# EAGLE design Simon-2022 (EAGLE 9.6.2)
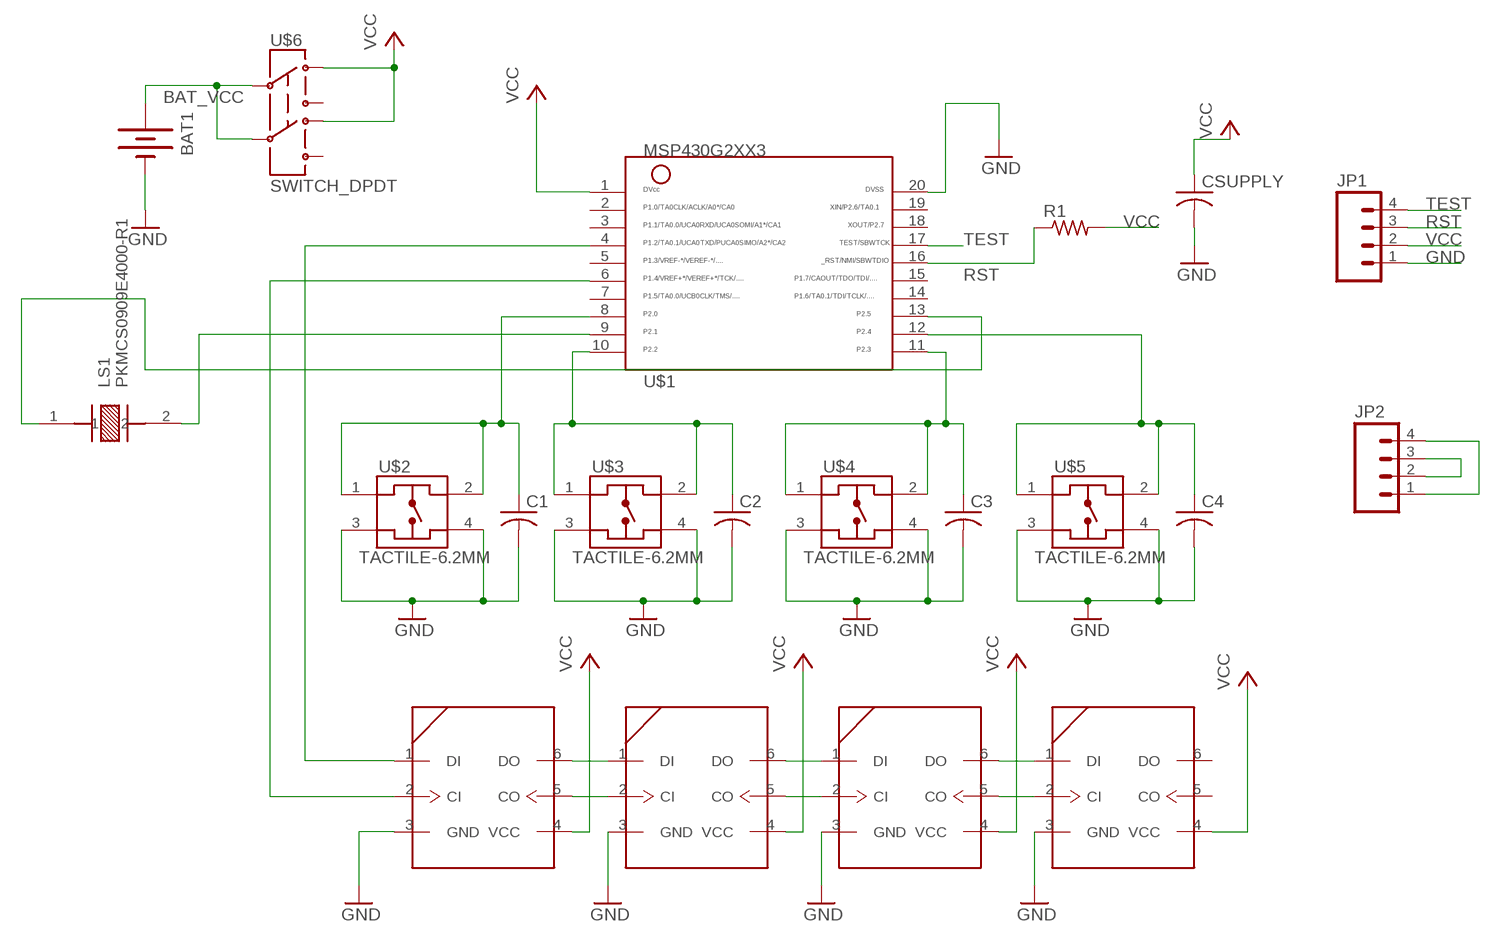
[diagram p0: schematic, sheet 1]

## Parts
BAT1  BATTERY  [BATTERY_PACK_2AA]
C1  C-USC1206  [C1206]
C2  C-USC1206  [C1206]
C3  C-USC1206  [C1206]
C4  C-USC1206  [C1206]
CSUPPLY  C-USC1206  [C1206]
JP1  M04LOCK  [1X04_LOCK]
JP2  M04LOCK  [1X04_LOCK]
LED1  APA102  [5050]
LED2  APA102  [5050]
LED3  APA102  [5050]
LED4  APA102  [5050]
LS1  PKMCS0909E4000-R1  [XDCR_PKMCS0909E4000-R1]
R1  R-US_R1206  [R1206]
U$1  MSP430G2XX3TSSOP  [PW20]
U$2  TACTILE-6.2MM  [222_AM]
U$3  TACTILE-6.2MM  [222_AM]
U$4  TACTILE-6.2MM  [222_AM]
U$5  TACTILE-6.2MM  [222_AM]
U$6  SWITCH_DPDT  [JS_DPDT_TH]

## Nets
BAT_VCC: BAT1.3V(+) U$6.2 U$6.5
GND: BAT1.GND(-) C1.2 C2.2 C3.2 C4.2 CSUPPLY.2 JP1.1 LED1.3(GND) LED2.3(GND) LED3.3(GND) LED4.3(GND) U$1.20 U$2.3 U$2.4 U$3.3 U$3.4 U$4.3 U$4.4 U$5.3 U$5.4
N$1: LED1.6(DO) LED2.1(DI)
N$2: LED1.5(CO) LED2.2(CI)
N$3: LED2.6(DO) LED3.1(DI)
N$4: LED2.5(CO) LED3.2(CI)
N$5: LED3.6(DO) LED4.1(DI)
N$6: LED3.5(CO) LED4.2(CI)
N$7: LED1.1(DI) U$1.4
N$8: LED1.2(CI) U$1.6
N$9: C2.1 U$1.10 U$3.1 U$3.2
N$10: LS1.2 U$1.9
N$11: LS1.1 U$1.13
N$12: C1.1 U$1.8 U$2.1 U$2.2
N$13: JP2.1 JP2.4
N$14: JP2.2 JP2.3
N$16: C3.1 U$1.11 U$4.1 U$4.2
N$20: C4.1 U$1.12 U$5.1 U$5.2
RST: JP1.3 R1.1 U$1.16
TEST: JP1.4 U$1.17
VCC: CSUPPLY.1 JP1.2 LED1.4(VCC) LED2.4(VCC) LED3.4(VCC) LED4.4(VCC) R1.2 U$1.1 U$6.1 U$6.4
Unconnected: LED4.5(CO) LED4.6(DO) U$1.2 U$1.3 U$1.5 U$1.7 U$1.14 U$1.15 U$1.18 U$1.19 U$6.3 U$6.6

## Library data of the parts
BAT1 = ELEC327:BATTERY: Battery Holders Various common sizes : AA, AAA, 20mm coin cell and 12mm coin cell. 20MM_4LEGS, BATT-10373
C1-C4 CSUPPLY = rcl:C-US: CAPACITOR, American symbol; SPICEPREFIX: C
JP1 JP2 = SparkFun:M04: Header 4 Standard 4-pin 0.1" header. Use with straight break away headers (SKU : PRT-00116), right angle break away headers (PRT-00553), swiss pins (PRT-00743), machine pins (PRT-00117), and female headers (PRT-00115). Molex polarized connector foot print use with SKU : PRT-08231 with associated crimp pins and housings. 1MM SMD Version SKU: PRT-10208
LED1-LED4 = ELEC327:APA102: APA102 SPI RGB LED APA102 is a chainable RGB LED. The control protocol is a variant of SPI.
LS1 = ELEC327:PKMCS0909E4000-R1: Audio Sounder Piezo Solder Pad Surface Mount; DESCRIPTION: Buzzers Transducer, Externally Driven Piezo 1.5V 4kHz 65dB @ 1.5V, 10cm Surface Mount Solder Pads; DIGI-KEY_PART_NUMBER: 490-9647-1-ND; DIGI-KEY_PURCHASE_URL: https://www.digikey.com/product-detail/en/murata-electronics/PKMCS0909E4000-R1/490-9647-1-ND/4878401?utm_source=snapeda&utm_medium=aggregator&utm_campaign=symbol; MF: Murata; MP: PKMCS0909E4000-R1; PACKAGE: 2010 Murata
R1 = resistor:R-US_: RESISTOR, American symbol
U$1 = ELEC327:MSP430G2XX3: MSP430G2XX3 PDIP (N) 20 Pin Package
U$2-U$5 = ELEC327:TACTILE-6.2MM: CTS 6.2 x 6.2 mm Tactile Switch CTS Part Number 222AMVBAR (SMD) Digikey part CT3088TR-ND
U$6 = ELEC327:SWITCH_DPDT

## Board
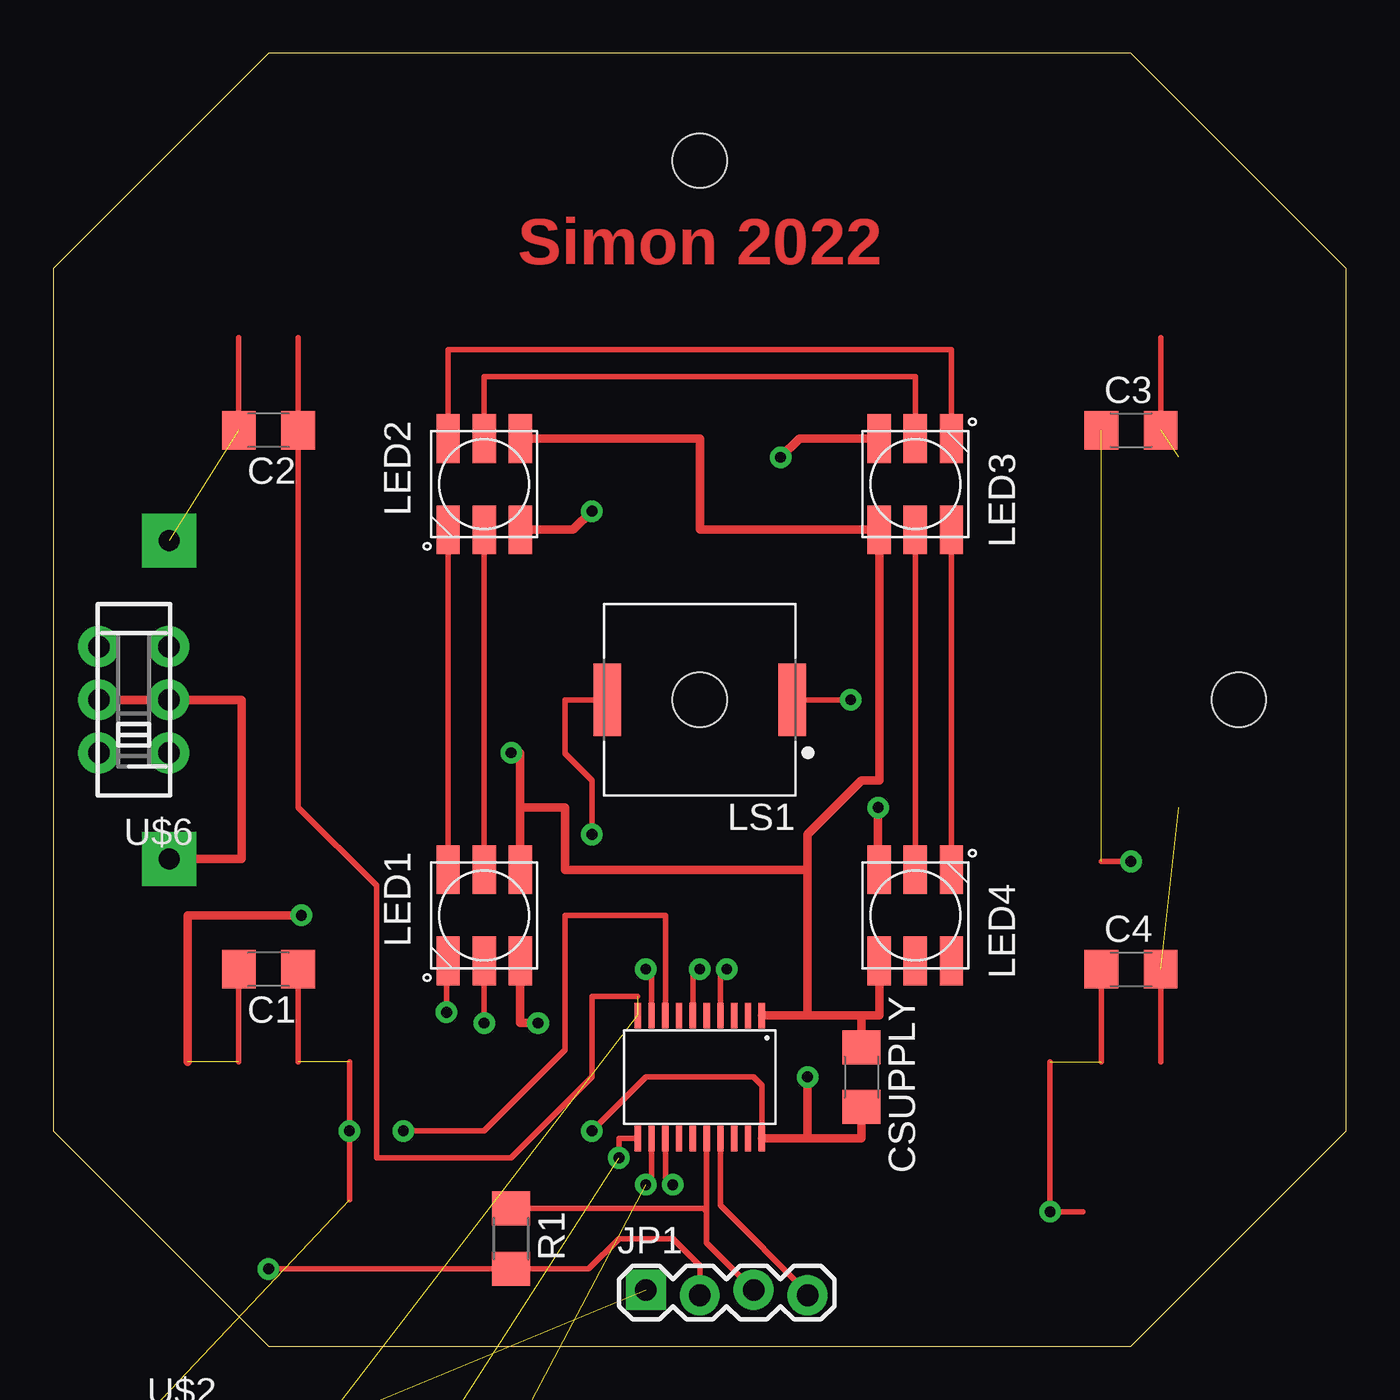
[diagram p1: board, top side]
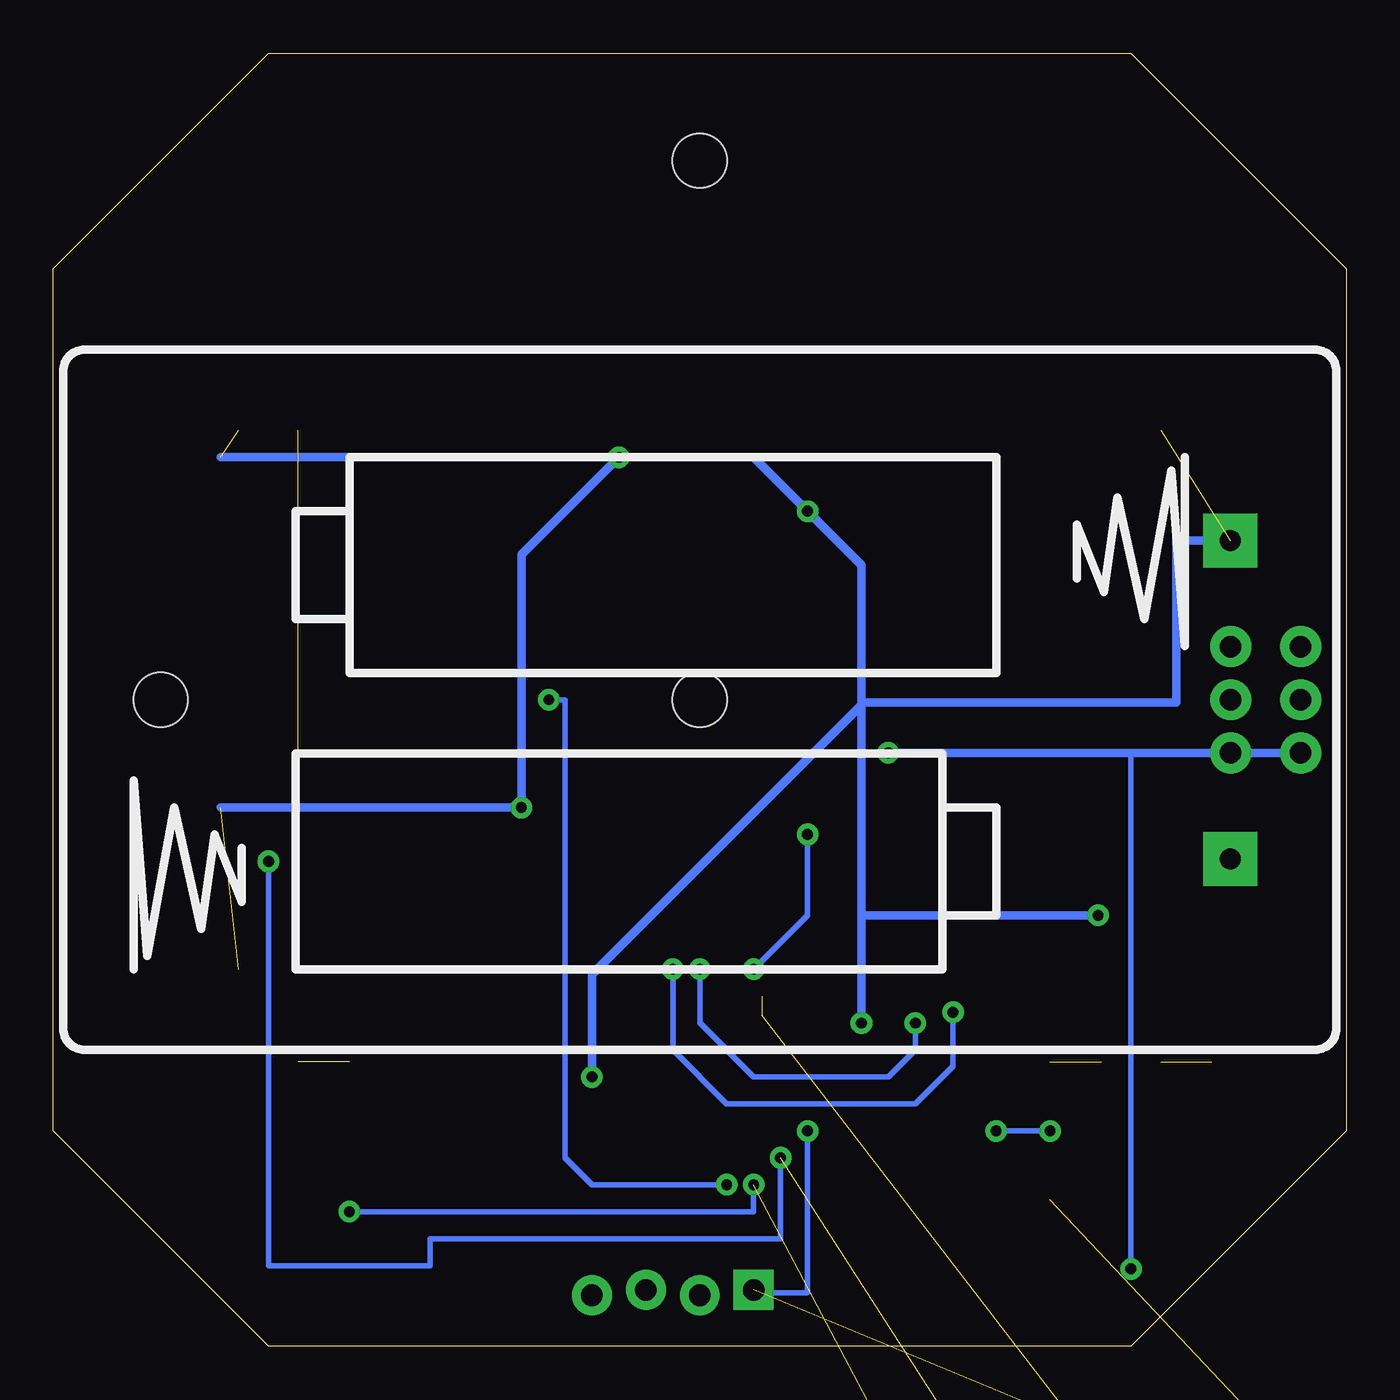
[diagram p2: board, bottom side, seen from below]

Size 60.96 x 60.96 mm. Coordinates in mm from the lower left corner, seen from the top.
Outline: 0,50.8 0,10.16 10.16,0 50.8,0 60.96,10.16 60.96,50.8 50.8,60.96 10.16,60.96 0,50.8
Copper layers (1*16): Top 0.035mm / dielectric 1.5mm / Bottom 0.035mm
Design rules "AdvancedCircuitsBarebones": minimum track width 6mil, minimum drill 20mil, track to track 6mil, track to pad 6mil, pad to pad 6mil, via to via 6mil, smd to smd 6mil, copper to edge 10mil, drill to drill 6mil, minimum pad ring 12mil, minimum via ring 10mil, stop-mask expansion 4mil, vias tented up to drill 25mil, thermal gap 10mil
Holes 2.54 mm at 30.48,30.48 30.48,55.88 55.88,30.48

### Footprints (pad centres in the part's own frame; a part is rotated, then mirrored left to right if it is on the bottom)
BATTERY_PACK_2AA = drill 1 pad 2.54 square: 3V 7.5,25; GND -7.5,25
C1206 = smd 1.6 x 1.8: 1 -1.4,0; 2 1.4,0
1X04_LOCK = drill 1.016 pad 1.88 square: 1 0,0.127 | drill 1.016 pad 1.88: 2 2.54,-0.127; 3 5.08,0.127; 4 7.62,-0.127
5050 = smd 2.3 x 1.1: 1 -2.15,1.7; 2 -2.15,0; 3 -2.15,-1.7; 4 2.15,-1.7; 5 2.15,0; 6 2.15,1.7
XDCR_PKMCS0909E4000-R1 = smd 1.3 x 3.4: 1 -4.35,0; 2 4.35,0
R1206 = smd 1.6 x 1.803: 1 -1.422,0; 2 1.422,0
PW20 = smd 0.3 x 1.2: 1 -2.925,-2.9; 2 -2.275,-2.9; 3 -1.625,-2.9; 4 -0.975,-2.9; 5 -0.325,-2.9; 6 0.325,-2.9; 7 0.975,-2.9; 8 1.625,-2.9; 9 2.275,-2.9; 10 2.925,-2.9; 11 2.925,2.9; 12 2.275,2.9; 13 1.625,2.9; 14 0.975,2.9; 15 0.325,2.9; 16 -0.325,2.9; 17 -0.975,2.9; 18 -1.625,2.9; 19 -2.275,2.9; 20 -2.925,2.9
222_AM = smd 1.6 x 1.4: 1 -4,2.25; 2 -4,-2.25; 3 4,2.25; 4 4,-2.25
JS_DPDT_TH = drill 1 pad 1.93: 1 -2.5,-1.65; 2 0,-1.65; 3 2.5,-1.65; 4 -2.5,1.65; 5 0,1.65; 6 2.5,1.65

### Placement (x,y rotation side)
BAT1  30.48,30.48 270 bottom
C1  10.16,17.78 180 top
C2  10.16,43.18 180 top
C3  50.8,43.18 0 top
C4  50.8,17.78 0 top
CSUPPLY  38.1,12.7 270 top
JP1  27.94,2.54 0 top
JP2  2.54,-50.8 0 top  (outside the outline)
LED1  20.32,20.32 90 top
LED2  20.32,40.64 90 top
LED3  40.64,40.64 270 top
LED4  40.64,20.32 270 top
LS1  30.48,30.48 180 top
R1  21.59,5.08 270 top
U$1  30.48,12.7 180 top
U$2  7.62,-6.35 0 top  (outside the outline)
U$3  7.62,-17.78 0 top  (outside the outline)
U$4  7.62,-29.21 0 top  (outside the outline)
U$5  7.62,-40.64 0 top  (outside the outline)
U$6  3.81,30.48 90 top

### Tracks (layer width: path | path; a pad name or v marks a point on that pad's centre or on a via)
BAT_VCC
  Top 0.406: BAT1.3V 8.89,22.98 8.89,30.48 U$6.2 U$6.5
GND  (via drill 0.51)  (12 unrouted)
  Top 0.254: U$1.20 33.41,12.31 33.02,12.7 27.94,12.7 v25.4,10.16 | C4.2 52.2,13.41 | C3.2 52.2,47.55 | C2.2 8.76,47.55 | C1.2 8.76,13.41
  Top 0.406: 35.56,9.8 38.1,9.8 CSUPPLY.2 | LED4.3 38.89,22.52 v38.89,25.4 | LED1.3 22.02,15.24 v22.86,15.24 | LED2.3 24.52,38.49 v25.4,39.37 | v34.29,41.91 35.17,42.79 LED3.3 | v35.56,12.7 35.56,9.8 | v11.71,20.32 6.35,20.32 6.35,13.41 | 35.56,9.8 U$1.20
  Bottom 0.254: v25.4,10.16 25.4,2.54 27.81,2.54 JP1.1
  Bottom 0.406: v34.29,41.91 27.94,41.91 v25.4,39.37 22.86,36.83 22.86,30.48 | v34.29,41.91 38.89,37.31 v38.89,25.4 53.06,25.4 | v22.86,15.24 22.86,20.32 | 22.86,20.32 22.86,30.48 | 22.74,30.36 22.86,30.48 | 22.74,30.36 8.02,30.36 8.02,38.1 7.9,38.1 7.9,37.98 BAT1.GND | 22.74,30.36 35.56,17.54 v35.56,12.7 | 53.06,41.91 v34.29,41.91 | v11.71,20.32 22.86,20.32
N$1
  Top 0.254: LED1.6 LED2.1
N$2
  Top 0.254: LED1.5 LED2.2
N$3
  Top 0.254: LED2.6 18.62,46.99 42.34,46.99 LED3.1
N$4
  Top 0.254: LED3.2 40.64,45.72 20.32,45.72 LED2.5
N$5
  Top 0.254: LED3.6 LED4.1
N$6
  Top 0.254: LED3.5 LED4.2
N$7  (via drill 0.51)
  Top 0.254: U$1.4 31.45,17.48 v31.75,17.78 | v18.54,15.75 18.54,18.09 LED1.1
  Bottom 0.254: v31.75,17.78 31.75,13.97 29.21,11.43 20.32,11.43 18.54,13.21 v18.54,15.75
N$8  (via drill 0.51)
  Top 0.254: LED1.2 v20.32,15.24 | U$1.6 30.16,17.45 v30.48,17.78
  Bottom 0.254: v30.48,17.78 30.48,15.24 27.94,12.7 21.59,12.7 20.32,13.97 v20.32,15.24
N$9  (3 unrouted)
  Top 0.254: 11.56,47.55 C2.1 11.56,25.4 15.24,21.72 15.24,8.89 21.59,8.89 25.4,12.7 25.4,16.51 27.55,16.51
N$10  (via drill 0.51)
  Top 0.254: U$1.9 28.2,17.52 v27.94,17.78 | v25.4,24.13 25.4,26.67 24.13,27.94 24.13,30.48 LS1.2
  Bottom 0.254: v25.4,24.13 25.4,20.32 v27.94,17.78
N$11  (via drill 0.51)
  Top 0.254: U$1.13 28.86,7.97 v29.21,7.62 | LS1.1 v37.59,30.48
  Bottom 0.254: v29.21,7.62 35.56,7.62 36.83,8.89 36.83,30.48 v37.59,30.48
N$12  (via drill 0.51)  (3 unrouted)
  Top 0.254: C1.1 11.56,13.41 | 13.97,6.91 v13.97,10.16 13.97,13.41 | U$1.8 28.86,20.32 24.13,20.32 24.13,13.97 20.32,10.16 v16.51,10.16
  Bottom 0.254: v16.51,10.16 v13.97,10.16
N$13  (1 unrouted)
N$14  (1 unrouted)
N$16  (via drill 0.51)  (3 unrouted)
  Top 0.254: v50.8,22.86 49.4,22.86 | U$1.11 26.67,9.8 v26.67,8.89
  Bottom 0.254: v50.8,22.86 50.8,3.81 43.18,3.81 43.18,5.08 26.67,5.08 v26.67,8.89
N$20  (via drill 0.51)  (3 unrouted)
  Top 0.254: U$1.12 28.2,7.88 v27.94,7.62 | 48.54,6.35 v46.99,6.35 46.99,13.41 | C4.1 49.4,13.41
  Bottom 0.254: v27.94,7.62 27.94,6.35 v46.99,6.35
RST
  Top 0.254: JP1.3 30.8,4.88 30.8,6.35 | 30.8,6.35 U$1.16 | R1.1 30.65,6.5 30.8,6.35
TEST
  Top 0.254: U$1.17 31.45,6.64 35.56,2.54 JP1.4
VCC  (via drill 0.51)
  Top 0.254: JP1.2 30.48,3.81 29.21,5.08 26.67,5.08 25.25,3.66 R1.2 v10.16,3.66
  Top 0.406: LED2.4 30.48,42.79 30.48,38.49 LED3.4 38.94,26.67 38.1,26.67 35.56,24.13 35.56,22.47 | U$1.1 35.56,15.6 | 35.56,15.6 38.1,15.6 | 38.1,15.6 CSUPPLY.1 | LED4.4 38.94,15.6 38.1,15.6 | 35.56,22.47 24.13,22.47 24.13,25.4 22.02,25.4 | 35.56,22.47 35.56,15.6 | v21.59,27.98 22.02,27.98 22.02,25.4 | LED1.4 22.02,25.4
  Bottom 0.254: 10.16,27.98 v10.16,3.66
  Bottom 0.406: v21.59,27.98 10.16,27.98 U$6.1 U$6.4

### Text on the board
Top: Simon 2022